# EAGLE design balance_pcb (EAGLE 8.2.2)
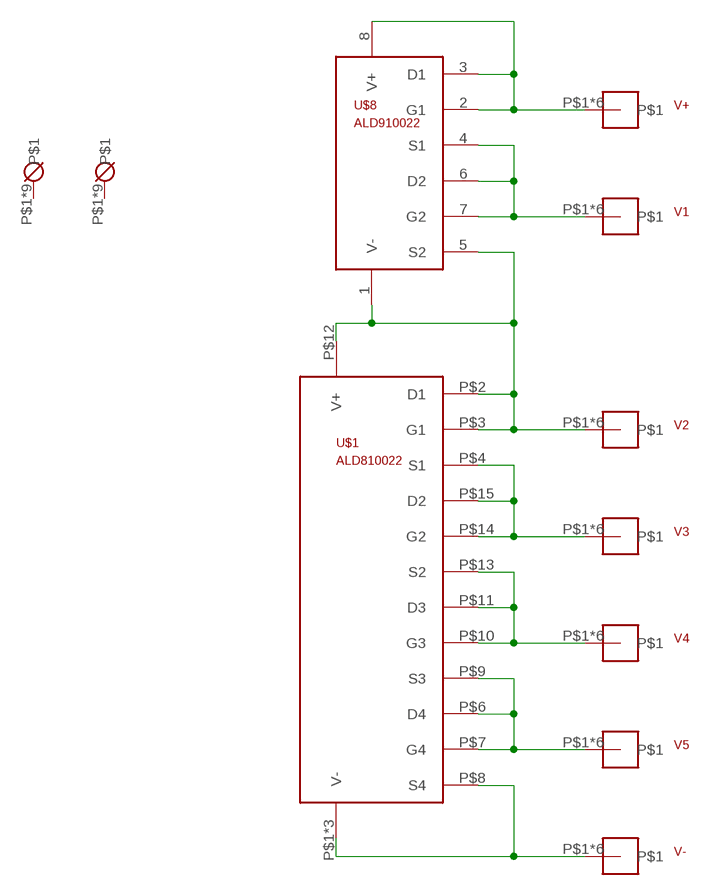
[diagram p0: schematic, sheet 1]

## Parts
U$1  ALD810022  ALD8100XXSOIC  [SOIC16_NARROW]
U$2  MOUNTING_HOLE  [MOUNTING_HOLE_#4]
U$3  MOUNTING_HOLE  [MOUNTING_HOLE_#4]
U$8  ALD910022  ALD9100XX  [SOIC8]
V1  WIRE_PAD100MIL  [WIRE_PAD]
V2  WIRE_PAD100MIL  [WIRE_PAD]
V3  WIRE_PAD100MIL  [WIRE_PAD]
V4  WIRE_PAD100MIL  [WIRE_PAD]
V5  WIRE_PAD100MIL  [WIRE_PAD]
V+  WIRE_PAD100MIL  [WIRE_PAD]
V-  WIRE_PAD100MIL  [WIRE_PAD]

## Nets
N$1: U$1.P$1(V-) U$1.P$5(V-) U$1.P$8(S4) U$1.P$16(V-) V-.P$1 V-.P$2 V-.P$3 V-.P$4 V-.P$5 V-.P$6
N$2: U$1.P$10(G3) U$1.P$11(D3) U$1.P$13(S2) V4.P$1 V4.P$2 V4.P$3 V4.P$4 V4.P$5 V4.P$6
N$3: U$8.4(S1) U$8.6(D2) U$8.7(G2) V1.P$1 V1.P$2 V1.P$3 V1.P$4 V1.P$5 V1.P$6
N$4: U$1.P$6(D4) U$1.P$7(G4) U$1.P$9(S3) V5.P$1 V5.P$2 V5.P$3 V5.P$4 V5.P$5 V5.P$6
N$6: U$1.P$4(S1) U$1.P$14(G2) U$1.P$15(D2) V3.P$1 V3.P$2 V3.P$3 V3.P$4 V3.P$5 V3.P$6
N$8: U$8.2(G1) U$8.3(D1) U$8.8(V+) V+.P$1 V+.P$2 V+.P$3 V+.P$4 V+.P$5 V+.P$6
N$9: U$1.P$2(D1) U$1.P$3(G1) U$1.P$12(V+) U$8.1(V-) U$8.5(S2) V2.P$1 V2.P$2 V2.P$3 V2.P$4 V2.P$5 V2.P$6
Unconnected: U$2.P$1 U$2.P$2 U$2.P$3 U$2.P$4 U$2.P$5 U$2.P$6 U$2.P$7 U$2.P$8 U$2.P$9 U$3.P$1 U$3.P$2 U$3.P$3 U$3.P$4 U$3.P$5 U$3.P$6 U$3.P$7 U$3.P$8 U$3.P$9

## Library data of the parts
U$1 = ALD8100xx:ALD8100XX
U$2 U$3 = ALD8100xx:MOUNTING_HOLE
U$8 = ALD8100xx:ALD9100XX
V1-V5 V+ V- = ALD8100xx:WIRE_PAD

## Board
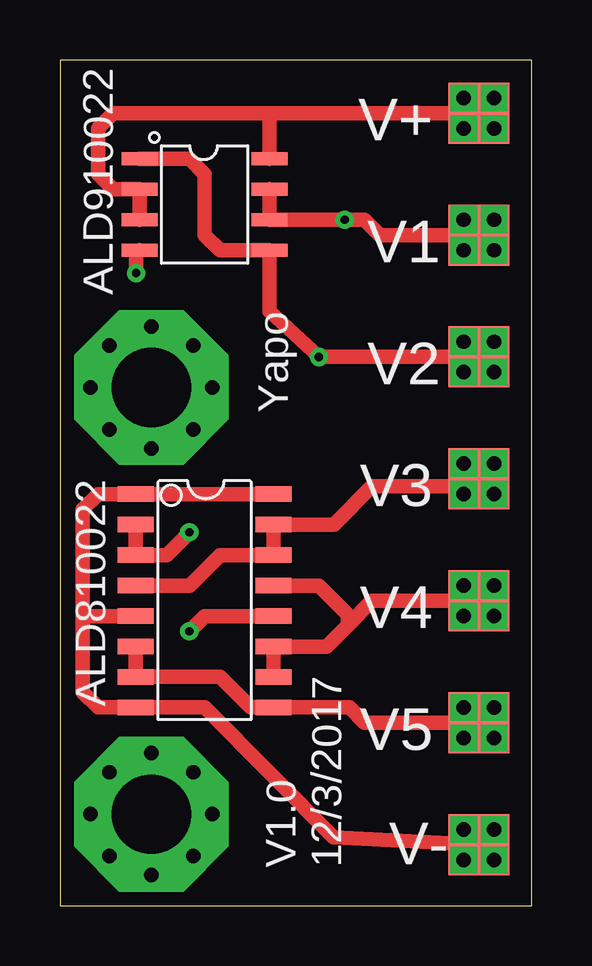
[diagram p1: board, top side]
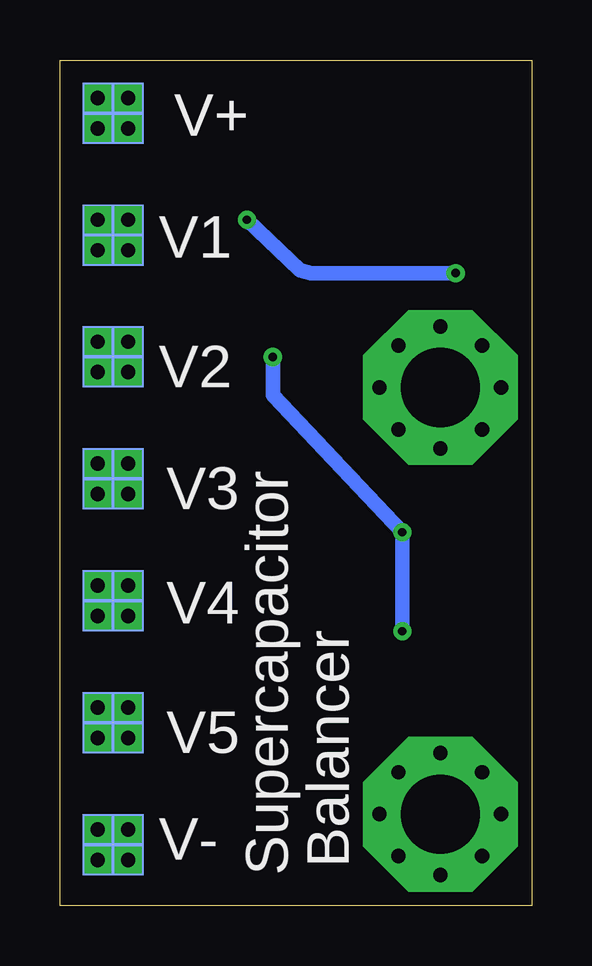
[diagram p2: board, bottom side, seen from below]

Size 19.67 x 35.23 mm. Coordinates in mm from the lower left corner, seen from the top.
Outline: 0,0 19.67,0 19.67,35.23 0,35.23 0,0
Copper layers (1*16): Top 0.035mm / dielectric 1.5mm / Bottom 0.035mm
Design rules "default": minimum track width 6mil, minimum drill 0.35mm, track to track 6mil, track to pad 6mil, pad to pad 6mil, via to via 6mil, smd to smd 6mil, copper to edge 40mil, drill to drill 6mil, minimum pad ring 10mil, minimum via ring 8mil, stop-mask expansion 4mil, vias tented up to drill 0mil, thermal gap 10mil

### Footprints (pad centres in the part's own frame; a part is rotated, then mirrored left to right if it is on the bottom)
SOIC16_NARROW = smd 0.65 x 1.5: P$1 -4.445,-2.875; P$2 -3.175,-2.875; P$3 -1.905,-2.875; P$4 -0.635,-2.875; P$5 0.635,-2.875; P$6 1.905,-2.875; P$7 3.175,-2.875; P$8 4.445,-2.875; P$9 4.445,2.875; P$10 3.175,2.875; P$11 1.905,2.875; P$12 0.635,2.875; P$13 -0.635,2.875; P$14 -1.905,2.875; P$15 -3.175,2.875; P$16 -4.445,2.875
MOUNTING_HOLE_#4 = drill 3.302 pad 6.452 octagon: P$1 0,0 | drill 0.6 pad 0.813 octagon: P$2 0,2.54; P$3 -2.54,0; P$4 2.54,0; P$5 0,-2.54; P$6 -1.746,1.746; P$7 1.746,1.746; P$8 -1.746,-1.746; P$9 1.746,-1.746
SOIC8 = smd 0.55 x 1.5: 1 -1.905,-2.7; 2 -0.635,-2.7; 3 0.635,-2.7; 4 1.905,-2.7; 5 1.905,2.7; 6 0.635,2.7; 7 -0.635,2.7; 8 -1.905,2.7
WIRE_PAD = smd 2.54 x 2.54: P$1 0,0 | drill 0.6 square: P$2 -0.635,0.635; P$3 0.635,0.635; P$4 0.635,-0.635; P$5 -0.635,-0.635 | smd 2.54 x 2.54 bottom: P$6 0,0

### Placement (x,y rotation side)
U$1  6.03,12.7 270 top
U$2  3.81,3.81 0 top
U$3  3.81,21.59 0 top
U$8  6.03,29.21 270 top
V1  17.46,27.94 0 top
V2  17.46,22.86 0 top
V3  17.46,17.78 0 top
V4  17.46,12.7 0 top
V5  17.46,7.62 0 top
V+  17.46,33.02 0 top
V-  17.46,2.54 0 top

### Tracks (layer width: path | path; a pad name or v marks a point on that pad's centre or on a via)
N$1  (1 unrouted)
  Top 0.61: U$1.P$16 U$1.P$1 1.59,17.14 0.95,16.51 0.95,12.01 | V-.P$6 11.41,2.86 8.87,5.42 6.03,8.26 U$1.P$8 1.59,8.26 0.95,8.89 0.95,12.01 | U$1.P$5 1,12.06 0.95,12.01
  Bottom 0.076: V-.P$6 V-.P$2 | V-.P$6 V-.P$3 | V-.P$6 V-.P$5 | V-.P$6 | V-.P$4 18.08,1.91 V-.P$6
N$2  (1 unrouted)
  Top 0.61: U$1.P$10 U$1.P$11 11.11,10.79 12,11.69 | V4.P$6 13.02,12.7 12,11.69 | U$1.P$13 10.79,13.34 12,12.13 12,11.69
  Bottom 0.076: 17.41,12.75 V4.P$2 | 17.41,12.75 V4.P$6 V4.P$4 | V4.P$3 18,13.34 17.59,12.92 17.41,12.75 | V4.P$5 16.83,12.16 17.41,12.75
N$3  (via drill 0.35)  (1 unrouted)
  Top 0.61: V1.P$6 13.34,27.94 12.7,28.57 v11.88,28.57 U$8.6 U$8.7 | U$8.4 3.17,27.15 v3.17,26.35
  Bottom 0.076: 17.36,28.04 V1.P$2 | V1.P$6 17.36,28.04 | V1.P$6 | V1.P$3 17.9,28.57 17.52,28.2 | 17.52,28.2 17.36,28.04 | V1.P$5 16.83,27.32 V1.P$6 | V1.P$4 18.1,27.61 17.52,28.2
  Bottom 0.61: v3.17,26.35 9.21,26.35 9.65,26.48 v11.88,28.57
N$4  (1 unrouted)
  Top 0.61: U$1.P$6 U$1.P$7 6.67,9.53 7.94,8.26 U$1.P$9 12.06,8.26 12.7,7.62 V5.P$6
  Bottom 0.076: 17.45,7.64 V5.P$2 | 17.45,7.64 V5.P$6 V5.P$4 | V5.P$3 18.06,8.26 17.45,7.64 | V5.P$5 16.83,7.02 17.45,7.64
N$6  (1 unrouted)
  Top 0.61: V3.P$6 17.14,17.46 13.02,17.46 11.43,15.88 U$1.P$15 U$1.P$14 6.67,14.61 5.4,13.34 U$1.P$4
  Bottom 0.076: 17.45,17.79 V3.P$2 | 17.45,17.79 V3.P$6 V3.P$4 | V3.P$3 18.07,18.41 17.56,17.91 17.45,17.79 | V3.P$5 16.83,17.17 17.45,17.79
N$8
  Top 0.076: V+.P$3 V+.P$6 | V+.P$6 V+.P$2 | V+.P$6 V+.P$5 | V+.P$6 V+.P$4
  Top 0.61: 8.69,33.02 V+.P$6 | 8.69,33.02 2.22,33.02 1.59,32.38 1.59,30.48 2.22,29.84 U$8.2 U$8.3 | U$8.8 8.73,32.98 8.69,33.02
  Bottom 0.076: V+.P$2 V+.P$6
N$9  (via drill 0.35)  (1 unrouted)
  Top 0.61: U$1.P$2 U$1.P$3 4.45,14.61 v5.4,15.56 | U$8.1 5.4,31.11 6.03,30.48 6.03,27.94 6.67,27.3 U$8.5 8.73,24.77 v10.79,22.86 V2.P$6 | U$1.P$12 6.03,12.06 v5.4,11.43
  Bottom 0.076: 17.32,23 V2.P$2 | 17.44,22.88 17.32,23 | 17.44,22.88 V2.P$6 V2.P$4 | V2.P$3 17.82,23.5 17.32,23 | V2.P$5 16.83,22.27 17.44,22.88
  Bottom 0.61: v5.4,11.43 v5.4,15.56 10.79,21.27 v10.79,22.86

### Text on the board
tPlace: Yapo | V1.0 | 12/3/2017
bPlace: V+ | V1 | V2 | V3 | V4 | V5 | Balancer | V- | Supercapacitor